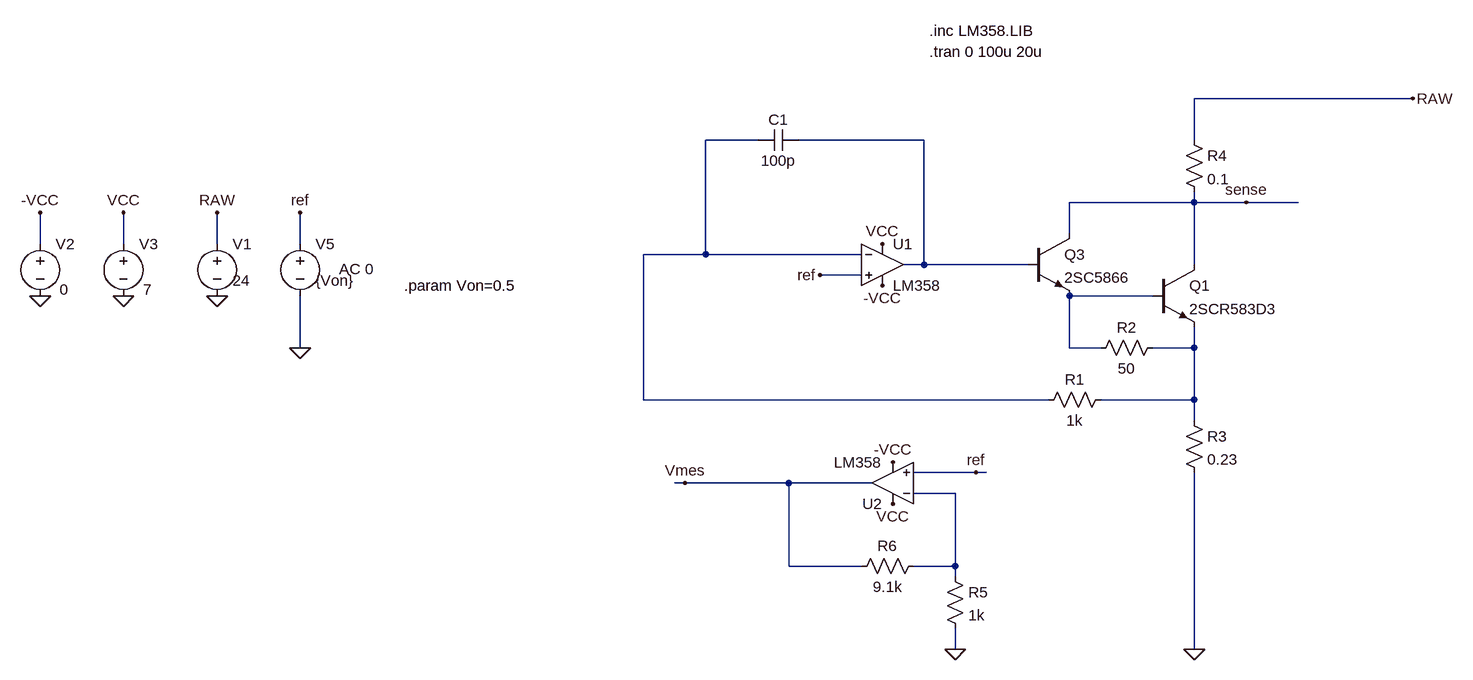
[diagram p0: schematic darlington-bjt-current-measurement.asc]
darlington-bjt-current-measurement.asc, the LTspice schematic file:
Version 4
SHEET 1 1508 724
WIRE 1024 -240 688 -240
WIRE 16 -176 -64 -176
WIRE 272 -176 80 -176
WIRE 688 -176 688 -240
WIRE 688 -80 688 -96
WIRE 688 -80 496 -80
WIRE 768 -80 688 -80
WIRE 848 -80 768 -80
WIRE 496 -32 496 -80
WIRE -1088 -16 -1088 -64
WIRE -960 -16 -960 -64
WIRE -816 -16 -816 -64
WIRE -688 -16 -688 -64
WIRE -64 0 -64 -176
WIRE -64 0 -160 0
WIRE 176 0 -64 0
WIRE 272 16 272 -176
WIRE 272 16 240 16
WIRE 432 16 272 16
WIRE 688 16 688 -80
WIRE 176 32 112 32
WIRE 624 64 496 64
WIRE -688 144 -688 64
WIRE 496 144 496 64
WIRE 544 144 496 144
WIRE 688 144 688 112
WIRE 688 144 624 144
WIRE -160 224 -160 0
WIRE 464 224 -160 224
WIRE 688 224 688 144
WIRE 688 224 544 224
WIRE 688 256 688 224
WIRE 352 336 256 336
WIRE 368 336 352 336
WIRE -96 352 -112 352
WIRE 64 352 -96 352
WIRE 192 352 64 352
WIRE 320 368 256 368
WIRE 64 480 64 352
WIRE 176 480 64 480
WIRE 320 480 320 368
WIRE 320 480 256 480
WIRE 320 496 320 480
WIRE 320 608 320 576
WIRE 688 608 688 336
FLAG -816 64 0
FLAG -816 -64 RAW
FLAG 208 -16 VCC
FLAG -960 64 0
FLAG -960 -64 VCC
FLAG 688 608 0
FLAG 1024 -240 RAW
FLAG -1088 64 0
FLAG -1088 -64 -VCC
FLAG 208 48 -VCC
FLAG -688 144 0
FLAG -688 -64 ref
FLAG 112 32 ref
FLAG 768 -80 sense
FLAG 224 384 VCC
FLAG 224 320 -VCC
FLAG 320 608 0
FLAG -96 352 Vmes
FLAG 352 336 ref
SYMBOL voltage -816 -32 R0
WINDOW 123 24 44 Left 2
WINDOW 39 0 0 Left 0
WINDOW 3 24 72 Left 2
SYMATTR Value 24
SYMATTR InstName V1
SYMBOL voltage -960 -32 R0
WINDOW 123 24 44 Left 2
WINDOW 39 0 0 Left 0
WINDOW 3 30 86 Left 2
SYMATTR Value 7
SYMATTR InstName V3
SYMBOL res 672 240 R0
SYMATTR InstName R3
SYMATTR Value 0.23
SYMBOL voltage -1088 -32 R0
WINDOW 123 24 44 Left 2
WINDOW 39 0 0 Left 0
WINDOW 3 30 86 Left 2
SYMATTR Value 0
SYMATTR InstName V2
SYMBOL voltage -688 -32 R0
WINDOW 123 60 55 Left 2
WINDOW 39 0 0 Left 0
WINDOW 3 24 72 Left 2
SYMATTR Value2 AC 0
SYMATTR Value {Von}
SYMATTR InstName V5
SYMBOL OpAmps\\opamp2 208 -48 R0
SYMATTR InstName U1
SYMATTR Value LM358
SYMBOL res 560 208 R90
WINDOW 0 0 56 VBottom 2
WINDOW 3 32 56 VTop 2
SYMATTR InstName R1
SYMATTR Value 1k
SYMBOL cap 80 -192 R90
WINDOW 0 0 32 VBottom 2
WINDOW 3 32 32 VTop 2
SYMATTR InstName C1
SYMATTR Value 100p
SYMBOL res 640 128 R90
WINDOW 0 0 56 VBottom 2
WINDOW 3 32 56 VTop 2
SYMATTR InstName R2
SYMATTR Value 50
SYMBOL npn 432 -32 R0
SYMATTR InstName Q3
SYMATTR Value 2SC5866
SYMBOL npn 624 16 R0
SYMATTR InstName Q1
SYMATTR Value 2SCR583D3
SYMBOL res 672 -192 R0
SYMATTR InstName R4
SYMATTR Value 0.1
SYMBOL OpAmps\\opamp2 224 416 R180
SYMATTR InstName U2
SYMATTR Value LM358
SYMBOL res 304 480 R0
SYMATTR InstName R5
SYMATTR Value 1k
SYMBOL res 272 464 R90
WINDOW 0 0 56 VBottom 2
WINDOW 3 32 56 VTop 2
SYMATTR InstName R6
SYMATTR Value 9.1k
TEXT -528 48 Left 2 !.param Von=0.5
TEXT 280 -344 Left 2 !.inc LM358.LIB
TEXT 280 -312 Left 2 !.tran 0 100u 20u

The netlist it stands for:
* darlington-bjt-current-measurement.asc
V1 RAW 0 24
V3 VCC 0 7
R3 N004 0 0.23
V2 -VCC 0 0
V5 ref 0 {Von} AC 0
XU1 ref N001 VCC -VCC N002 LM358  ; pins In+ In- V+ V- OUT
R1 N004 N001 1k
C1 N002 N001 100p
R2 N004 N003 50
Q3 sense N002 N003 0 2SC5866
Q1 sense N003 N004 0 2SCR583D3
R4 RAW sense 0.1
XU2 ref N005 VCC -VCC Vmes LM358  ; pins In+ In- V+ V- OUT
R5 N005 0 1k
R6 N005 Vmes 9.1k
.model NPN NPN
.model PNP PNP
.lib standard.bjt
.param Von=0.5
.inc LM358.LIB
.tran 0 100u 20u
.backanno
.end